# Altium schematic sheet armslave.SchDoc
size Tabloid; SheetNumber: 1; SheetTotal: 1
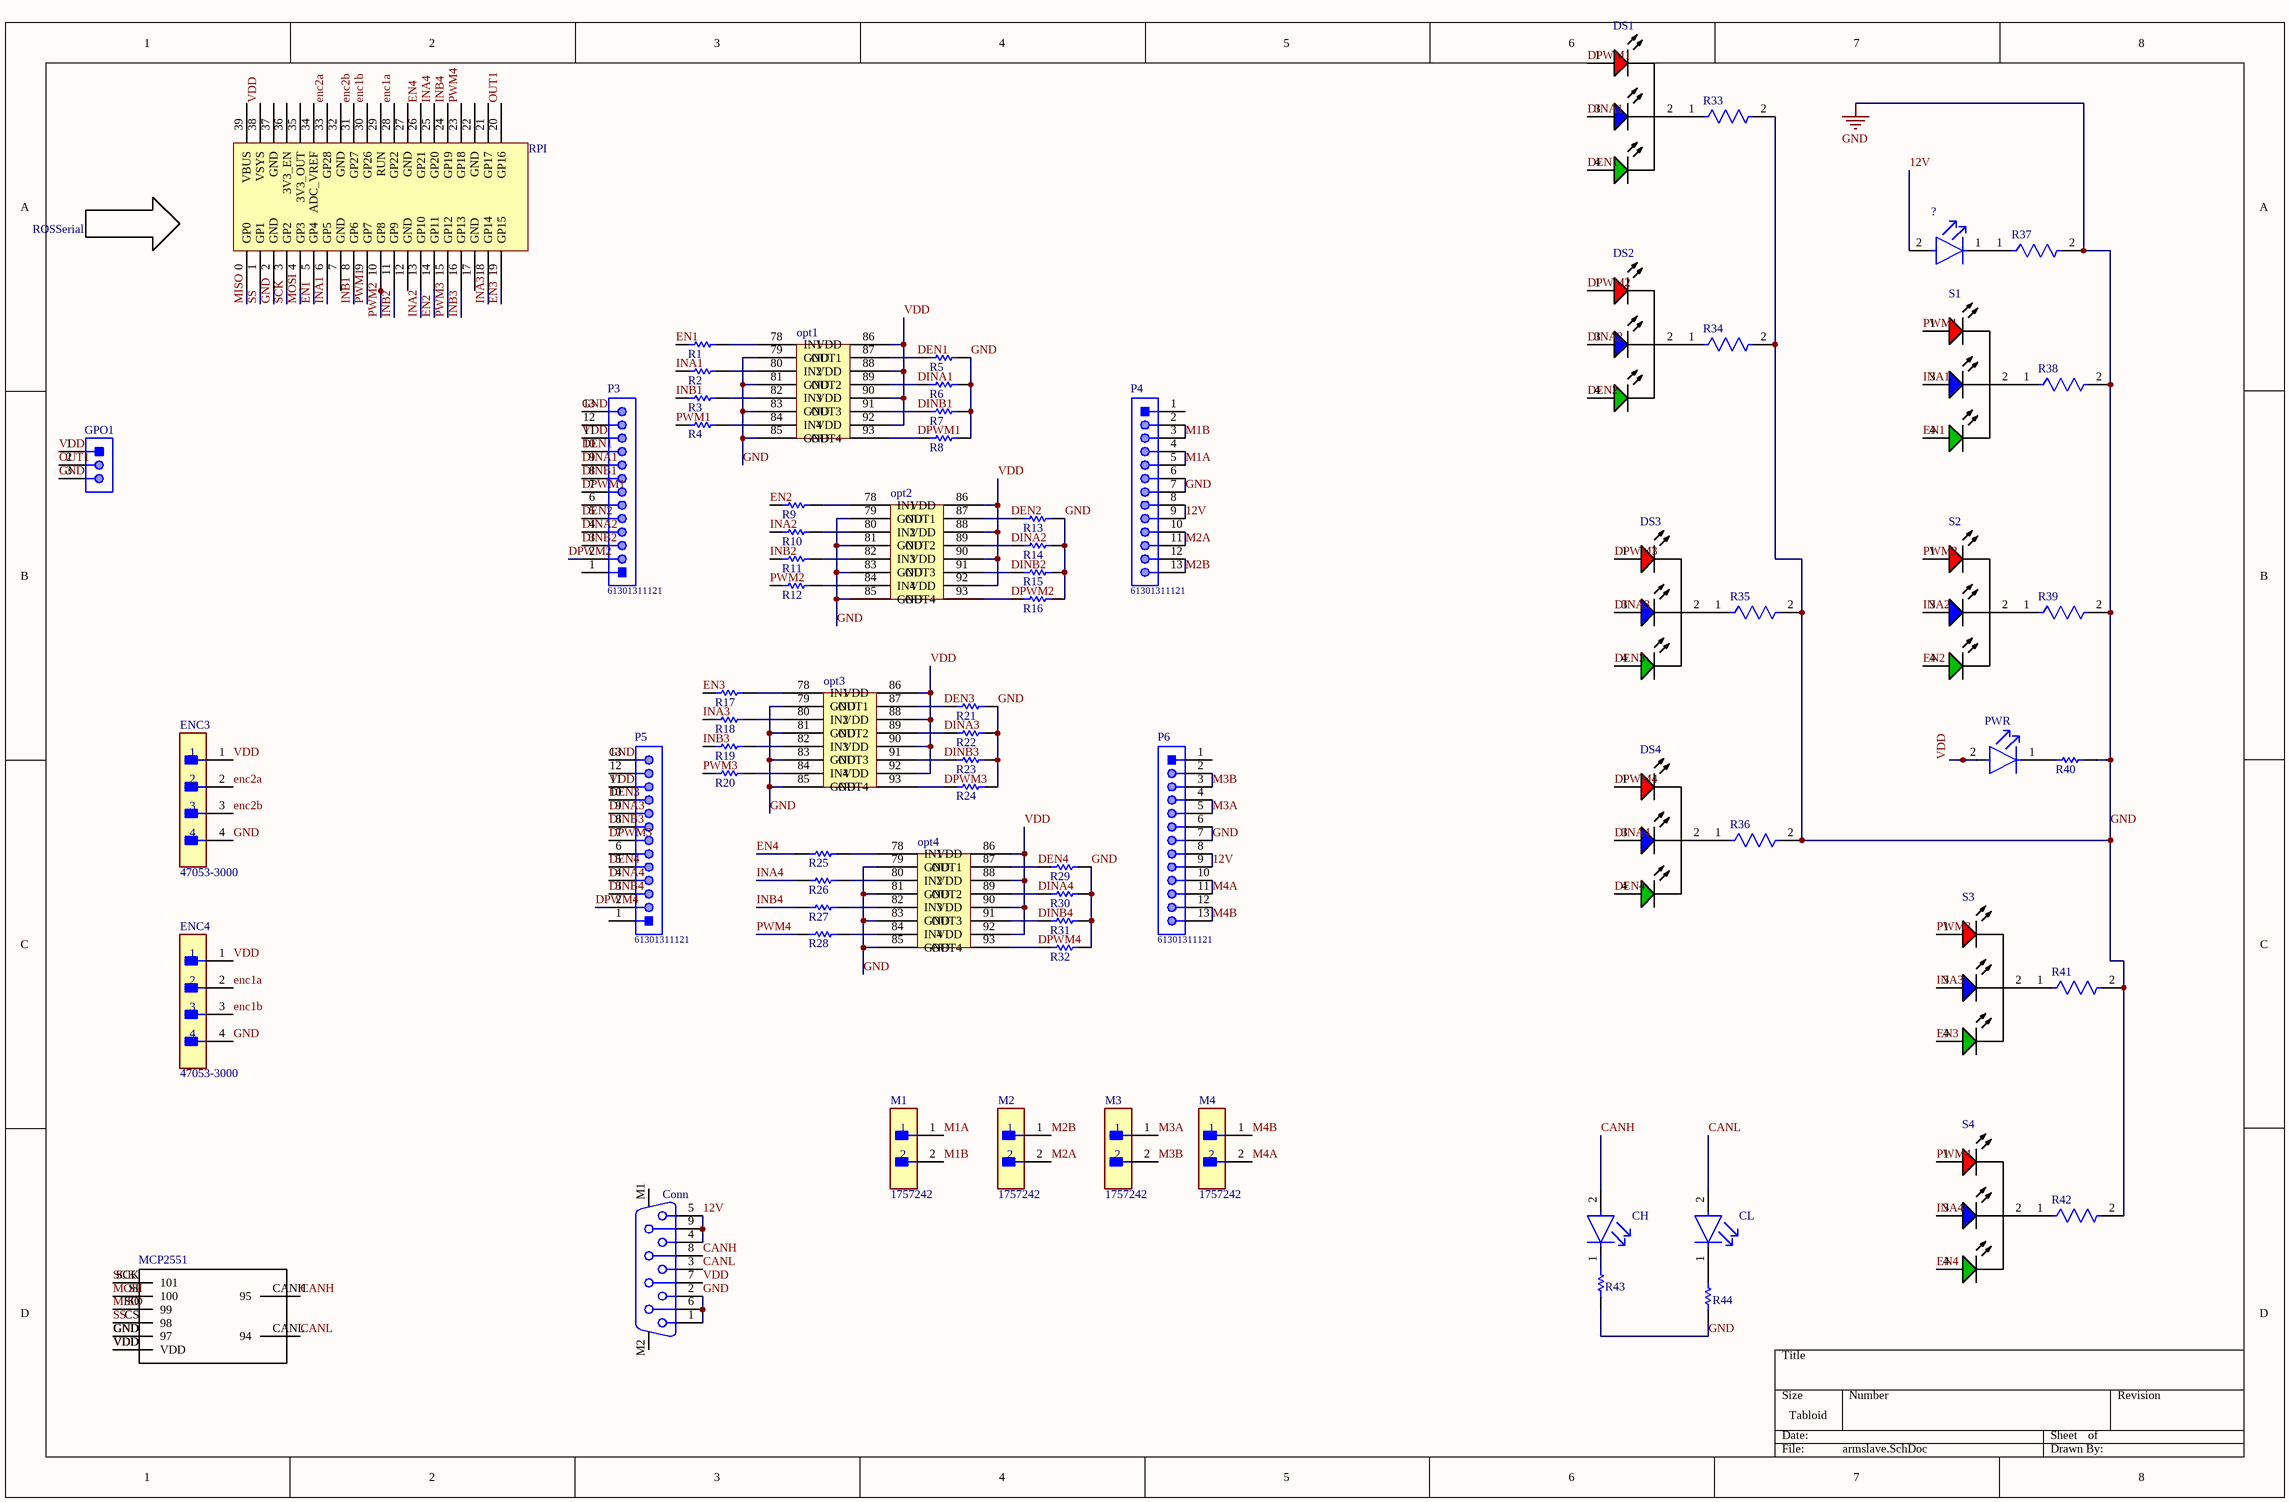
[diagram p0: armslave.SchDoc]

## Parts
?  SSL-LX5093YD  [FP-SSL-LX5093YD-MFG]  (value not drawn)
CH  HSMG-C150  [FP-HSMG-C150-MFG]  (value not drawn)
CL  HSMG-C150  [FP-HSMG-C150-MFG]  (value not drawn)
Conn  618009231121  [618009231121]  (value not drawn)
DS1  WP154A4SUREQBFZGC  [KING-WP154A4SUREQBFZGC_V]  (value not drawn)
DS2  WP154A4SUREQBFZGC  [KING-WP154A4SUREQBFZGC_V]  (value not drawn)
DS3  WP154A4SUREQBFZGC  [KING-WP154A4SUREQBFZGC_V]  (value not drawn)
DS4  WP154A4SUREQBFZGC  [KING-WP154A4SUREQBFZGC_V]  (value not drawn)
ENC3  47053-3000  [FP-47053-3000-MFG]
ENC4  47053-3000  [FP-47053-3000-MFG]
GPO1  22-28-4033  [MOLX-22-28-4033_V]  (value not drawn)
M1  1757242  [FP-1757242-MFG]
M2  1757242  [FP-1757242-MFG]
M3  1757242  [FP-1757242-MFG]
M4  1757242  [FP-1757242-MFG]
MCP2551  Component_1  [mcp2551]  (value not drawn)
opt1  Component_1  [PCBComponent_1]  (value not drawn)
opt2  Component_1  [PCBComponent_1]  (value not drawn)
opt3  Component_1  [PCBComponent_1]  (value not drawn)
opt4  Component_1  [PCBComponent_1]  (value not drawn)
P3  61301311121  [61301311121]
P4  61301311121  [61301311121]
P5  61301311121  [61301311121]
P6  61301311121  [61301311121]
PWR  HSMG-C150  [FP-HSMG-C150-MFG]  (value not drawn)
R1  ERA6AEB123V  [RESC2013X60X40ML20T25]  (value not drawn)
R2  ERA6AEB123V  [RESC2013X60X40ML20T25]  (value not drawn)
R3  ERA6AEB123V  [RESC2013X60X40ML20T25]  (value not drawn)
R4  ERA6AEB123V  [RESC2013X60X40ML20T25]  (value not drawn)
R5  ERA6AEB123V  [RESC2013X60X40ML20T25]  (value not drawn)
R6  ERA6AEB123V  [RESC2013X60X40ML20T25]  (value not drawn)
R7  ERA6AEB123V  [RESC2013X60X40ML20T25]  (value not drawn)
R8  ERA6AEB123V  [RESC2013X60X40ML20T25]  (value not drawn)
R9  ERA6AEB123V  [RESC2013X60X40ML20T25]  (value not drawn)
R10  ERA6AEB123V  [RESC2013X60X40ML20T25]  (value not drawn)
R11  ERA6AEB123V  [RESC2013X60X40ML20T25]  (value not drawn)
R12  ERA6AEB123V  [RESC2013X60X40ML20T25]  (value not drawn)
R13  ERA6AEB123V  [RESC2013X60X40ML20T25]  (value not drawn)
R14  ERA6AEB123V  [RESC2013X60X40ML20T25]  (value not drawn)
R15  ERA6AEB123V  [RESC2013X60X40ML20T25]  (value not drawn)
R16  ERA6AEB123V  [RESC2013X60X40ML20T25]  (value not drawn)
R17  ERA6AEB123V  [RESC2013X60X40ML20T25]  (value not drawn)
R18  ERA6AEB123V  [RESC2013X60X40ML20T25]  (value not drawn)
R19  ERA6AEB123V  [RESC2013X60X40ML20T25]  (value not drawn)
R20  ERA6AEB123V  [RESC2013X60X40ML20T25]  (value not drawn)
R21  ERA6AEB123V  [RESC2013X60X40ML20T25]  (value not drawn)
R22  ERA6AEB123V  [RESC2013X60X40ML20T25]  (value not drawn)
R23  ERA6AEB123V  [RESC2013X60X40ML20T25]  (value not drawn)
R24  ERA6AEB123V  [RESC2013X60X40ML20T25]  (value not drawn)
R25  ERA6AEB123V  [RESC2013X60X40ML20T25]  (value not drawn)
R26  ERA6AEB123V  [RESC2013X60X40ML20T25]  (value not drawn)
R27  ERA6AEB123V  [RESC2013X60X40ML20T25]  (value not drawn)
R28  ERA6AEB123V  [RESC2013X60X40ML20T25]  (value not drawn)
R29  ERA6AEB123V  [RESC2013X60X40ML20T25]  (value not drawn)
R30  ERA6AEB123V  [RESC2013X60X40ML20T25]  (value not drawn)
R31  ERA6AEB123V  [RESC2013X60X40ML20T25]  (value not drawn)
R32  ERA6AEB123V  [RESC2013X60X40ML20T25]  (value not drawn)
R33  MRS25000C1001FCT00  [FP-MRS25-MFG]  (value not drawn)
R34  MRS25000C1001FCT00  [FP-MRS25-MFG]  (value not drawn)
R35  MRS25000C1001FCT00  [FP-MRS25-MFG]  (value not drawn)
R36  MRS25000C1001FCT00  [FP-MRS25-MFG]  (value not drawn)
R37  MRS25000C1001FCT00  [FP-MRS25-MFG]  (value not drawn)
R38  MRS25000C1001FCT00  [FP-MRS25-MFG]  (value not drawn)
R39  MRS25000C1001FCT00  [FP-MRS25-MFG]  (value not drawn)
R40  ERA6AEB123V  [RESC2013X60X40ML20T25]  (value not drawn)
R41  MRS25000C1001FCT00  [FP-MRS25-MFG]  (value not drawn)
R42  MRS25000C1001FCT00  [FP-MRS25-MFG]  (value not drawn)
R43  ERA6AEB123V  [RESC2013X60X40ML20T25]  (value not drawn)
R44  ERA6AEB123V  [RESC2013X60X40ML20T25]  (value not drawn)
RPI  RPI-Pico-TH  [RPI-Pico-TH]  (value not drawn)
S1  WP154A4SUREQBFZGC  [KING-WP154A4SUREQBFZGC_V]  (value not drawn)
S2  WP154A4SUREQBFZGC  [KING-WP154A4SUREQBFZGC_V]  (value not drawn)
S3  WP154A4SUREQBFZGC  [KING-WP154A4SUREQBFZGC_V]  (value not drawn)
S4  WP154A4SUREQBFZGC  [KING-WP154A4SUREQBFZGC_V]  (value not drawn)

## Nets
GND: Conn.1 Conn.2 Conn.6 ENC3.4 ENC4.4 GPO1.3 MCP2551.GND(97) opt1.79(GND) opt1.81(GND) opt1.83(GND) opt1.85(GND) opt2.79(GND) opt2.81(GND) opt2.83(GND) opt2.85(GND) opt3.79(GND) opt3.81(GND) opt3.83(GND) opt3.85(GND) opt4.79(GND) opt4.81(GND) opt4.83(GND) opt4.85(GND) P3.13 P4.6 P4.7 P5.13 P6.6 P6.7 R5.1 R6.1 R7.1 R8.1 R13.1 R14.1 R15.1 R16.1 R21.1 R22.1 R23.1 R24.1 R29.1 R30.1 R31.1 R32.1 R33.2 R34.2 R35.2 R36.2 R37.2 R38.2 R39.2 R40.1 R41.2 R42.2 R43.2 R44.2 RPI.2(GND)
12V: ?.2(A) Conn.4 Conn.5 Conn.9 P4.8 P4.9 P6.8 P6.9
CANH: CH.2(A) Conn.8 MCP2551.CANH(95)
CANL: CL.2(A) Conn.3 MCP2551.CANL(94)
DEN1: DS1.4(GREEN) opt1.87(OUT1) P3.10 R5.2
DEN2: DS2.4(GREEN) opt2.87(OUT1) P3.5 R13.2
DEN3: DS3.4(GREEN) opt3.87(OUT1) P5.10 R21.2
DEN4: DS4.4(GREEN) opt4.87(OUT1) P5.5 R29.2
DINA1: DS1.3(BLUE) opt1.89(OUT2) P3.9 R6.2
DINA2: DS2.3(BLUE) opt2.89(OUT2) P3.4 R14.2
DINA3: DS3.3(BLUE) opt3.89(OUT2) P5.9 R22.2
DINA4: DS4.3(BLUE) opt4.89(OUT2) P5.4 R30.2
DINB1: opt1.91(OUT3) P3.8 R7.2
DINB2: opt2.91(OUT3) P3.3 R15.2
DINB3: opt3.91(OUT3) P5.8 R23.2
DINB4: opt4.91(OUT3) P5.3 R31.2
DPWM1: DS1.1(RED) opt1.93(OUT4) P3.7 R8.2
DPWM2: DS2.1(RED) opt2.93(OUT4) P3.2 R16.2
DPWM3: DS3.1(RED) opt3.93(OUT4) P5.7 R24.2
DPWM4: DS4.1(RED) opt4.93(OUT4) P5.2 R32.2
EN1: R1.2 RPI.5(GP4) S1.4(GREEN)
EN2: R9.2 RPI.14(GP11) S2.4(GREEN)
EN3: R17.2 RPI.19(GP15) S3.4(GREEN)
EN4: R25.2 RPI.26(GP21) S4.4(GREEN)
enc1a: ENC4.2 RPI.28(GP22)
enc1b: ENC4.3 RPI.30(GP26)
enc2a: ENC3.2 RPI.33(GP28)
enc2b: ENC3.3 RPI.31(GP27)
INA1: R2.2 RPI.6(GP5) S1.3(BLUE)
INA2: R10.2 RPI.13(GP10) S2.3(BLUE)
INA3: R18.2 RPI.18(GP14) S3.3(BLUE)
INA4: R26.2 RPI.25(GP20) S4.3(BLUE)
INB1: R3.2 RPI.8(GP6)
INB2: R11.2 RPI.11(GP9)
INB3: R19.2 RPI.16(GP13)
INB4: R27.2 RPI.24(GP19)
M1A: M1.1 P4.4 P4.5
M1B: M1.2 P4.2 P4.3
M2A: M2.2 P4.10 P4.11
M2B: M2.1 P4.12 P4.13
M3A: M3.1 P6.4 P6.5
M3B: M3.2 P6.2 P6.3
M4A: M4.2 P6.10 P6.11
M4B: M4.1 P6.12 P6.13
MISO: MCP2551.SO(99) RPI.0(GP0)
MOSI: MCP2551.SI(100) RPI.4(GP3)
OUT1: GPO1.2 RPI.20(GP16)
PWM1: R4.2 RPI.9(GP7) S1.1(RED)
PWM2: R12.2 RPI.10(GP8) S2.1(RED)
PWM3: R20.2 RPI.15(GP12) S3.1(RED)
PWM4: R28.2 RPI.23(GP18) S4.1(RED)
SCK: MCP2551.SCK(101) RPI.3(GP2)
SS: MCP2551.CS(98) RPI.1(GP1)
VDD: Conn.7 ENC3.1 ENC4.1 GPO1.1 MCP2551.VDD opt1.86(VDD) opt1.88(VDD) opt1.90(VDD) opt1.92(VDD) opt2.86(VDD) opt2.88(VDD) opt2.90(VDD) opt2.92(VDD) opt3.86(VDD) opt3.88(VDD) opt3.90(VDD) opt3.92(VDD) opt4.86(VDD) opt4.88(VDD) opt4.90(VDD) opt4.92(VDD) P3.11 P5.11 PWR.2(A) RPI.38(VSYS)
Net?_1: ?.1(C) R37.1
NetCH_1: CH.1(C) R43.1
NetCL_1: CL.1(C) R44.1
NetDS1_2: DS1.2(CATHODE) R33.1
NetDS2_2: DS2.2(CATHODE) R34.1
NetDS3_2: DS3.2(CATHODE) R35.1
NetDS4_2: DS4.2(CATHODE) R36.1
Netopt1_78: opt1.78(IN1) R1.1
Netopt1_80: opt1.80(IN2) R2.1
Netopt1_82: opt1.82(IN3) R3.1
Netopt1_84: opt1.84(IN4) R4.1
Netopt2_78: opt2.78(IN1) R9.1
Netopt2_80: opt2.80(IN2) R10.1
Netopt2_82: opt2.82(IN3) R11.1
Netopt2_84: opt2.84(IN4) R12.1
Netopt3_78: opt3.78(IN1) R17.1
Netopt3_80: opt3.80(IN2) R18.1
Netopt3_82: opt3.82(IN3) R19.1
Netopt3_84: opt3.84(IN4) R20.1
Netopt4_78: opt4.78(IN1) R25.1
Netopt4_80: opt4.80(IN2) R26.1
Netopt4_82: opt4.82(IN3) R27.1
Netopt4_84: opt4.84(IN4) R28.1
NetPWR_1: PWR.1(C) R40.2
NetR38_1: R38.1 S1.2(CATHODE)
NetR39_1: R39.1 S2.2(CATHODE)
NetR41_1: R41.1 S3.2(CATHODE)
NetR42_1: R42.1 S4.2(CATHODE)

Not connected (* = marked no-connect by the designer): Conn M1 M2; P3 1 6 12; P4 1; P5 1 6 12; P6 1; RPI 7(GND) 12(GND) 17(GND) 21(GP17) 22(GND) 27(GND) 29(RUN) 32(GND) 34(ADC_VREF) 35(3V3_OUT) 36(3V3_EN) 37(GND) 39(VBUS)

## Notes on the sheet
- ROSSerial

## Library data of the parts
? = CMP-57192-000007-1: LED YELLOW DIFFUSED T-1 3/4 T/H; Test Current: 20mA; Number of LEDs: 1; Dominant Wavelength: 568nm; Wavelength: 585nm; Forward Voltage: 2.1V; Lens Style: Dome; Viewing Angle: 60°; Luminous Intensity: 30mcd; Min Operating Temperature: -40°C; Packaging: Bulk; Width: 1.5inch; Lead Free: Lead Free; Number of Pins: 2; Color: Yellow; Case/Package: Radial; Forward Current: 20mA; REACH SVHC: No SVHC; Lens Transparency: Diffused; Weight: 0.01lb; Height: 8.6mm; Package Quantity: 1000; Series: -; Length: 0.5inch; Illumination Color: Yellow; Mount: Through Hole; Diameter: 5mm; RoHS Compliant: Yes; Lens Color: Yellow; Max Operating Temperature: 85°C
CH CL PWR = CMP-2000-05061-2: LED GREEN DIFFUSED 1206 SMD; Manufacturer: Broadcom; Led Orientation: Top View; Max Junction Temp: +95°C; Peak Emmision Wavelength: 570nm; Viewing Angle: 170°; Wavelength: 572nm; Reverse Voltage: 5V; Luminous Intensity: 15mcd; Description: Surface Mount Chip LEDs; Forward Voltage: 2.2V; Power Dissipation: 65mW; Forward Current: 20mA; ComponentLink2Description: Datasheet; Lead Free: Yes; Temperature Range Low: -40°C; Package: HSMG-C150; Digikey Description: LED GREEN DIFFUSED 1206 SMD; Mouser Description: LED Uni-Color Green 570nm 2-Pin Chip LED T/R; Manufacturer Part Number: HSMG-C150; Temperature Range High: +85°C; Device Class L1: Optoelectronics; Colour: Green; Category: Diode; Device Class L3: unset; RoHS: TRUE; Height: 1.2mm; ComponentLink2URL: https://docs.broadcom.com/docs/AV02-0551EN; Device Class L2: LEDs; Automotive: No; Ipc Land Pattern Name: DIOCP320160X55; Octopart: https://octopart.com/hsmg-c150-broadcom-71131304; Temperature: -40°C to +85°C
Conn = CMP-1502-00200-1: Female PCB Connector with Hex Screw WR-DSUB, 8.08 mm, Angled, 9 pins; Manufacturer: Wurth Elektronik; Contact Resistance: 30mOhm; Pin Number: 9; Working Voltage: 125VAC; Rated Current: 3A; Gender: Female; Datasheet URL: https://katalog.we-online.de/em/datasheet/6180xx231121.pdf; Packaging: Tray; Package Reference: 618009231121; Operating Temperature: -40to85degC; Manufacturer URL: http://www.we-online.de; Publisher: WurthElektronik; Mounting Technology: THT; Part Number: 618009231121; Orientation: Angled
DS1-DS4 = CMP-2000-07415-1: Full Color LED Lamp, Dominant Wavelength RGB 630 / 525 / 465 nm, -40 to 85 degC, 4-Pin THD, RoHS; Manufacturer: Kingbright; Viewing Angle: 50°; Wavelength - Dominant: 630nm,525nm,465nm; Online Catalog: 5mm,T-13/4(RGB)RoundwithDomedTopLEDLamp; Millicandela Rating: 1300mcdRed,1700mcdGreen,900mcdBlue; Other Names: 754-1615 / WP154A4SUREQBFZGC-ND; Current - Test: 20mA; Wavelength - Peak: 645nm,515nm,460nm; Color: Red,Green,Blue(RGB); Voltage - Forward (Vf) (Typ): 1.9VRed,3.3VGreen,3.3VBlue; Lens Type: Clear; 3D Model: WP154A4SUREQBFZGW.sldprt / WP154A4SUREQBFZGW.pro / WP154A4SUREQBFZGW.igs / WP154A4SUREQBFZGW.stp; Lens Style/Size: RoundwithDomedTop,5mm,T-13/4; Packaging: Bulk; Datasheet URL: https://www.kingbrightusa.com/images/catalog/spec/WP154A4SUREQBFZGC.pdf; Family: LEDIndication-Discrete; Datasheet Version: Rev. 5A, 08/2014; Category: Optoelectronics; Manufacturer URL: http://www.kingbright.com/; Height: 8.60mm; Mounting Type: ThroughHole; Package Reference: WP154A4SUREQBFZGC; Mounting Technology: ThroughHole; Package Description: 4-Pin Through Hole LED, Dia 5.9 mm, Pitch 1.27 mm; Standard Package: 500; Package / Case: Radial-4Leads
ENC3 ENC4 = CMP-04776-000447-1: CONN HEADER VERT 4POS 2.54MM; Glow Wire Compliant: Non-compliant; Voltage Rating: 250V; Current Rating: 4A; Number of Circuits: 4; Gender: Male; Orientation: Straight; Packaging: Bulk; Series: 47053; RoHS Compliant: Yes; Termination: Through Hole; Contact Plating: Tin; Mount: Through Hole; Number of Rows: 1; Pitch: 2.54mm; Halogen Free: Low Halogen; Number of Contacts: 4; Min Operating Temperature: 0°C; Package Quantity: 12000; Contact Material: Copper Alloy; Max Operating Temperature: 75°C; REACH SVHC: No SVHC; Number of Positions: 4
GPO1 = CMP-1676-00001-5: Male Header, Pitch 2.54 mm, 1 x 3 Position, Height 8.38 mm, Tail Length 3.18 mm, RoHS, Bulk; Manufacturer: Molex; Rows: 1; Voltage Rating: 250 V; Current Rating: 4 A; Min Operating Temperature: 0 degC; Lead Pitch: 0.1 inch; Packaging: Bulk; Contact Finish: Gold; RoHSCompliant: true; Contact Material: Brass; PackageReference: 22-28-4033; REACH SVHC: Unknown; PackageDescription: Male Header, Pitch 2.54 mm, 1 x 3 Position, Height 8.38 mm, Tail Length 3.18 mm; ComponentLink2URL: http://www.molex.com/pdm_docs/sd/022284033_sd.pdf; Height: 8.38 mm; Mounting Technology: Through Hole; ComponentLink1Description: Manufacturer URL; Length: 7.62 mm; Mount: Through Hole; DatasheetVersion: Rev. G, 01/2012; Max Operating Temperature: 75 degC; ComponentLink2Description: Datasheet; Colour: Black; Pins: 3; Contact Plating: Gold; Package Quantity: 1; ComponentLink1URL: http://www.molex.com/
M1-M4 = CMP-09399-000010-1: TERM BLOCK HDR 2POS 90DEG 5.08MM; Number of Poles: 2; Voltage Rating (DC): 320V; Number of Levels: 1; Voltage Rating: 250V; Current: 15A; Gender: Male; Current Rating: 12A; Voltage: 300V; Approvals: UL; Connector Type: Plug; Package Quantity: 50; Weight: 5.396916oz; Mount: Through Hole; Lead Free: Lead Free; Depth: 12mm; Contact Plating: Tin; Housing Material: PBT; Color: Grey; REACH SVHC: No SVHC; Number of Contacts: 2; Flammability Rating: UL94 V-0; Length: 12.16mm; Housing Color: Green; RoHS Compliant: Yes; Contact Material: Tin; Height: 12.08mm; Orientation: Right Angle; Termination: Solder; Pitch: 5.08mm; Number of Positions: 2; Packaging: Bulk; Number of Rows: 1; Number of Positions Per Level: 2; Width: 12.1mm; Max Current Rating: 12A; Series: MSTBA
MCP2551 = Component_1: pin to pad: CANH>35 CANL>34 CS>30 GND>29 SCK>33 SI>32 SO>31 VDD>28
opt1-opt4 = Component_1: pin to pad: 78>19 79>18 80>17 81>16 82>15 83>14 84>13 85>12 86>27 87>26 88>25 89>24 90>23 91>22 92>21 93>20
P3-P6 = CMP-1502-01089-1: THT Vertical Pin Header WR-PHD, Pitch 2.54 mm, Single Row, 13 pins; Manufacturer: Wurth Elektronik; Rated Current: 3A; Working Voltage: 250VAC; Contact Resistance: 20mOhm; Withstanding Voltage: 500VAC; Pin Number: 13; Pitch: 2.54mm; Gender: Male; Part Number: 61301311121; Packaging: Bag; Publisher: WurthElektronik; Row Number: Single; Mounting Technology: THT; Manufacturer URL: http://www.we-online.de; Operating Temperature: -40to105degC; Package Reference: 61301311121; Orientation: Vertical; Datasheet URL: https://katalog.we-online.de/em/datasheet/6130xx11121.pdf
R1-R32 R40 R43 R44 = CMP-2001-00590-1: Manufacturer: Panasonic; Part Number: ERA6AEB123V
R33-R39 R41 R42 = CMP-02408-000051-1: RES 1K OHM 0.6W 1% AXIAL; Power Rating: 600mW; Lead Diameter: 0.6mm; Voltage Rating (DC): 350V; Resistance: 1kR; Temperature Coefficient: 50ppm/°C; Width: 2.5mm; Military Standard: Not; Package Quantity: 5000; Radiation Hardening: No; Case/Package: Axial; Resistance Tolerance: 1%; Resistor Type: Metal Film; Contact Plating: Tin; Length: 6.5mm; Lead Free: Lead Free; RoHS Compliant: Yes; Mount: Through Hole; Number of Pins: 2; Technology: THIN FILM; Voltage Rating: 350V; Min Operating Temperature: -55°C; Weight: 0.00776oz; Diameter: 2.5mm; Construction: Cylindrical; Series: MRS25; Tolerance: 1%; Packaging: Tape and Reel; Max Operating Temperature: 155°C; Max Power Dissipation: 600mW; Number of Terminations: 2; Termination: Axial
RPI = RPI_PICO: Manufacturer: Raspberry-Pi
S1-S4 = CMP-2000-07415-1: Full Color LED Lamp, Dominant Wavelength RGB 630 / 525 / 465 nm, -40 to 85 degC, 4-Pin THD, RoHS; Manufacturer: Kingbright; Viewing Angle: 50°; Wavelength - Dominant: 630nm,525nm,465nm; Online Catalog: 5mm,T-13/4(RGB)RoundwithDomedTopLEDLamp; Millicandela Rating: 1300mcdRed,1700mcdGreen,900mcdBlue; Other Names: 754-1615 / WP154A4SUREQBFZGC-ND; Current - Test: 20mA; Wavelength - Peak: 645nm,515nm,460nm; Voltage - Forward (Vf) (Typ): 1.9VRed,3.3VGreen,3.3VBlue; Lens Type: Clear; 3D Model: WP154A4SUREQBFZGW.sldprt / WP154A4SUREQBFZGW.pro / WP154A4SUREQBFZGW.igs / WP154A4SUREQBFZGW.stp; Lens Style/Size: RoundwithDomedTop,5mm,T-13/4; Packaging: Bulk; Datasheet URL: https://www.kingbrightusa.com/images/catalog/spec/WP154A4SUREQBFZGC.pdf; Family: LEDIndication-Discrete; Color: Red,Green,Blue(RGB); Datasheet Version: Rev. 5A, 08/2014; Category: Optoelectronics; Manufacturer URL: http://www.kingbright.com/; Height: 8.60mm; Mounting Type: ThroughHole; Package Reference: WP154A4SUREQBFZGC; Mounting Technology: ThroughHole; Package Description: 4-Pin Through Hole LED, Dia 5.9 mm, Pitch 1.27 mm; Standard Package: 500; Package / Case: Radial-4Leads